# EAGLE design ASM4002 (EAGLE 6.3)
DATABASE: ./../../../../../Components/TinyCircuits_Part_Database.txt
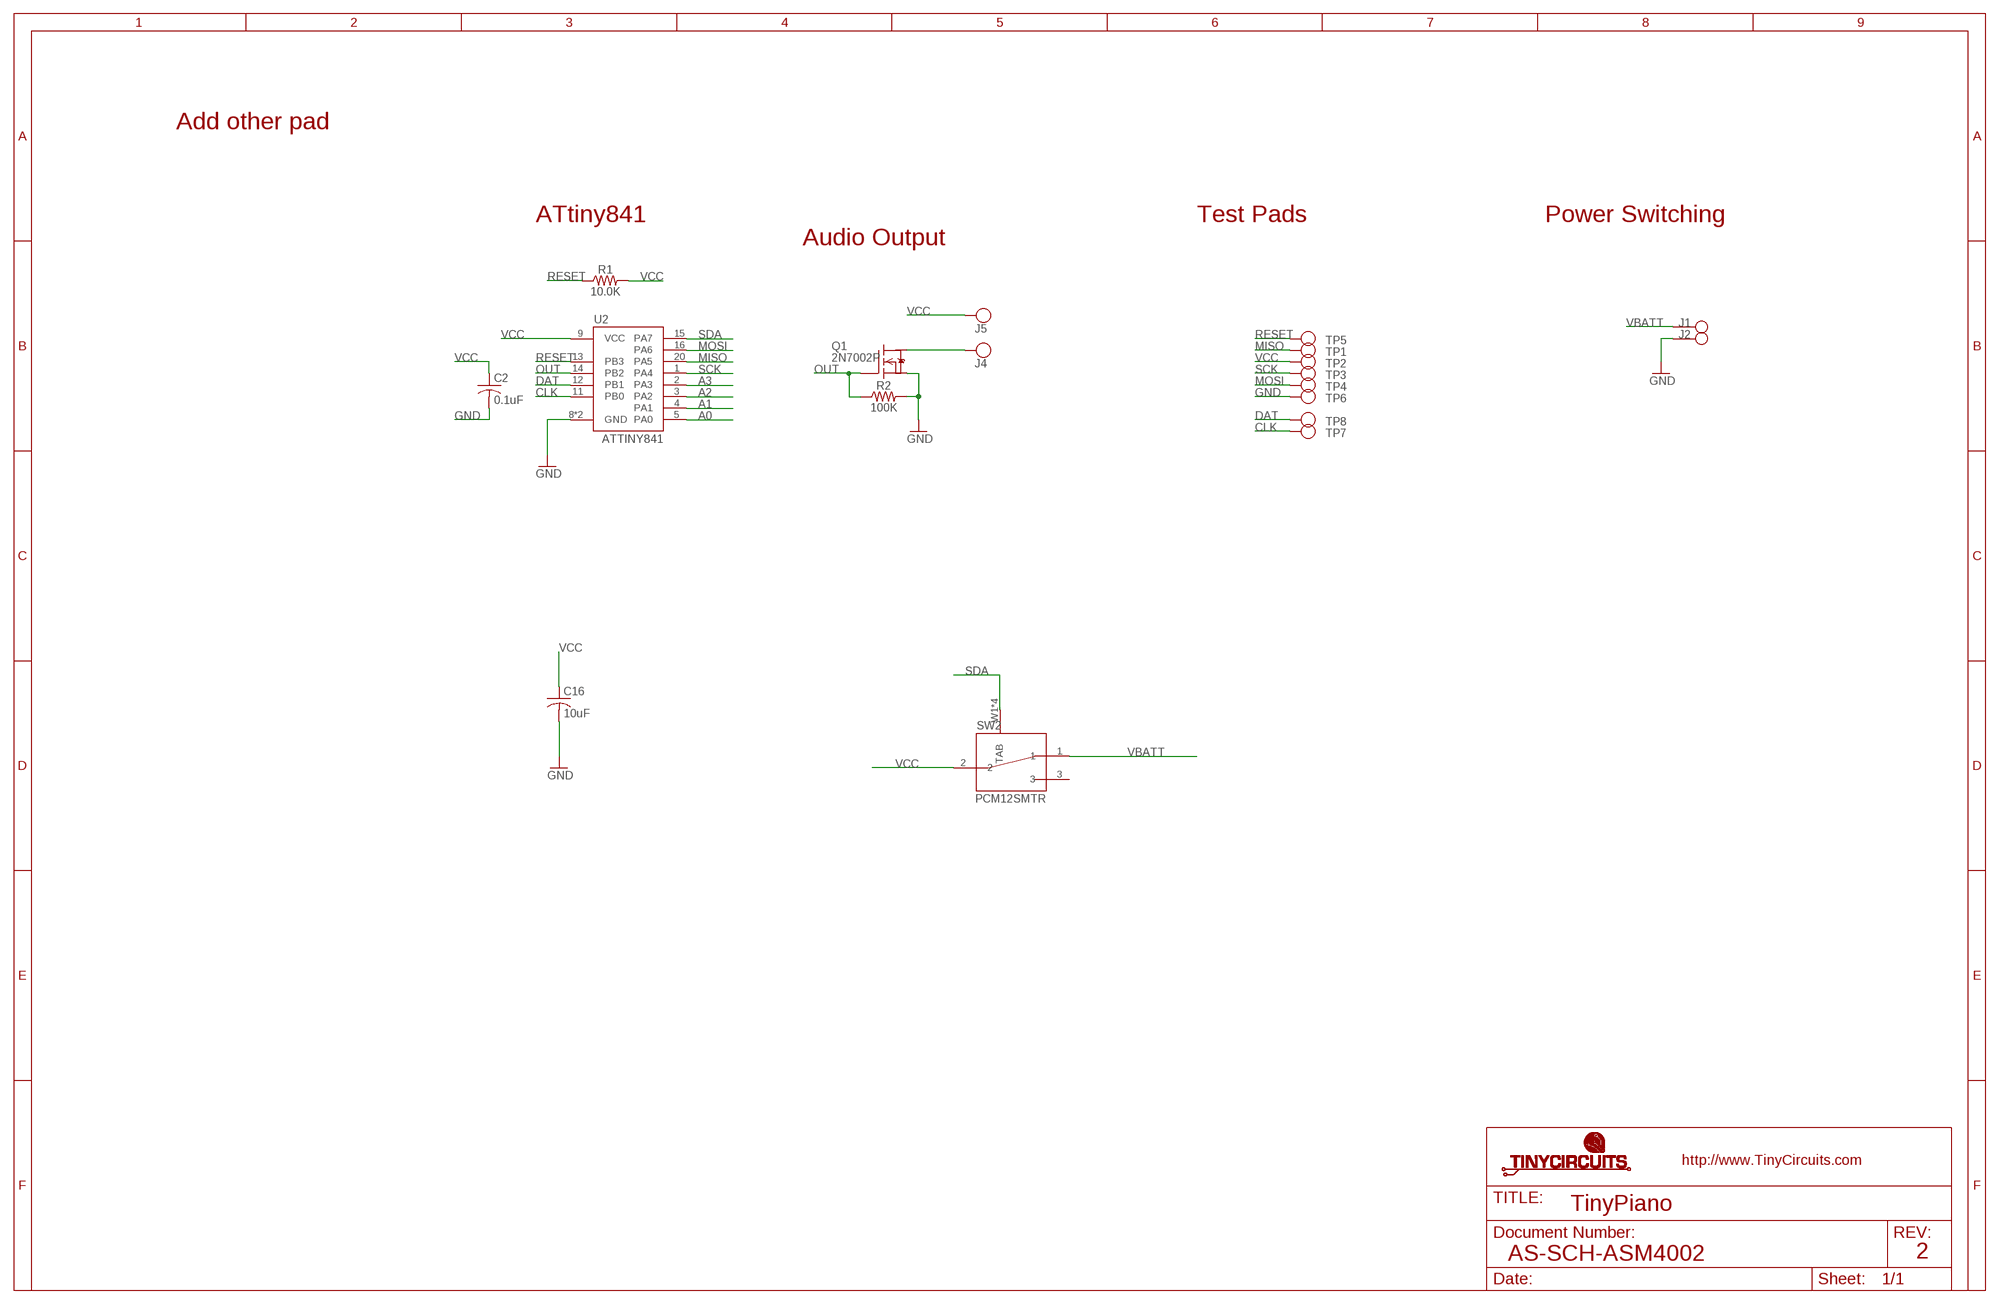
[diagram p0: schematic, sheet 1]

## Parts
C2  0.1uF  AS-ITM-00008  [C0402]
C16  10uF  AS-ITM-00002  [C0603]
J1  PIN_1X.1"  1.4MM_TH  [1.4MM_TH]
J2  1.4MM_TH  [1.4MM_TH]
J4  PIN_1X.1"1  [1X.1"_2]
J5  PIN_1X.1"1  [1X.1"_2]
Q1  2N7002P  AS-ITM-00007C  [SOT23A]
R1  10.0K  AS-ITM-00032  [0402]
R2  100K  AS-ITM-00004  [0402]
SW2  PCM12SMTR  AS-ITM-00220  [PCM12SMTR]
TP1  TEST_POINT  [TEST_POINT_1MM]
TP2  TEST_POINT  [TEST_POINT_1MM]
TP3  TEST_POINT  [TEST_POINT_1MM]
TP4  TEST_POINT  [TEST_POINT_1MM]
TP5  TEST_POINT  [TEST_POINT_1MM]
TP6  TEST_POINT  [TEST_POINT_1MM]
TP7  TEST_POINT  [TEST_POINT_1MM]
TP8  TEST_POINT  [TEST_POINT_1MM]
U2  ATTINY841  AS-ITM-00255  [VQFN-20]

## Nets
A0: U2.5(PA0)
A1: U2.4(PA1)
A2: U2.3(PA2)
A3: U2.2(PA3)
CLK: TP7.P$1 U2.11(PB0)
DAT: TP8.P$1 U2.12(PB1)
GND: C2.2 C16.2 J2.P$1 Q1.E(S) R2.2 TP6.P$1 U2.8(GND) U2.PAD(GND)
MISO: TP1.P$1 U2.20(PA5)
MOSI: TP4.P$1 U2.16(PA6)
N$2: J4.1 Q1.C(D)
OUT: Q1.B(G) R2.1 U2.14(PB2)
RESET: R1.1 TP5.P$1 U2.13(PB3)
SCK: TP3.P$1 U2.1(PA4)
SDA: SW2.W1(TAB) SW2.W2(TAB) SW2.W3(TAB) SW2.W4(TAB) U2.15(PA7)
VBATT: J1.P$1 SW2.1
VCC: C2.1 C16.1 J5.1 R1.2 SW2.2 TP2.P$1 U2.9(VCC)
Unconnected: SW2.3

## Notes on the sheet
- Add other pad
- ATtiny841 | Test Pads | Power Switching
- Audio Output
- TinyPiano
- AS-SCH-ASM4002 | 2

## Library data of the parts
C2 = tinycircuits:AS-ITM-00008: CAP CER 0.1UF 16V 10% X5R 0402; PARTNO: AS-ITM-00008
C16 = tinycircuits:AS-ITM-00002: CAP CER 10UF 10V 20% X5R 0603; PARTNO: AS-ITM-00002
J1 J2 = tinycircuits:1.4MM_TH: 1.4MM Through-Hole Pad for use with pogo pins
J4 J5 = tinycircuits:PIN_1X.1": 1 Pin 0.100" Header
Q1 = tinycircuits:AS-ITM-00007: MOSFET N-CH SGL 60V SOT-23; PARTNO: AS-ITM-00007
R1 = tinycircuits:AS-ITM-00032: RES 10.0K OHM 1/16W 1% 0402 SMD; PARTNO: AS-ITM-00032
R2 = tinycircuits:AS-ITM-00004: RES 100K OHM 1/16W 1% 0402; PARTNO: AS-ITM-00004
SW2 = tinycircuits:AS-ITM-00220: SW SLIDE SP2T 6VDC 0.3A SMT; PARTNO: AS-ITM-00220; PNPROTATION: 0
TP1-TP8 = tinycircuits:TEST_POINT: Test point, no drill
U2 = tinycircuits:AS-ITM-00255: IC MCU 8BIT 8KB FLASH 20VQFN; PARTNO: AS-ITM-00255

## Board
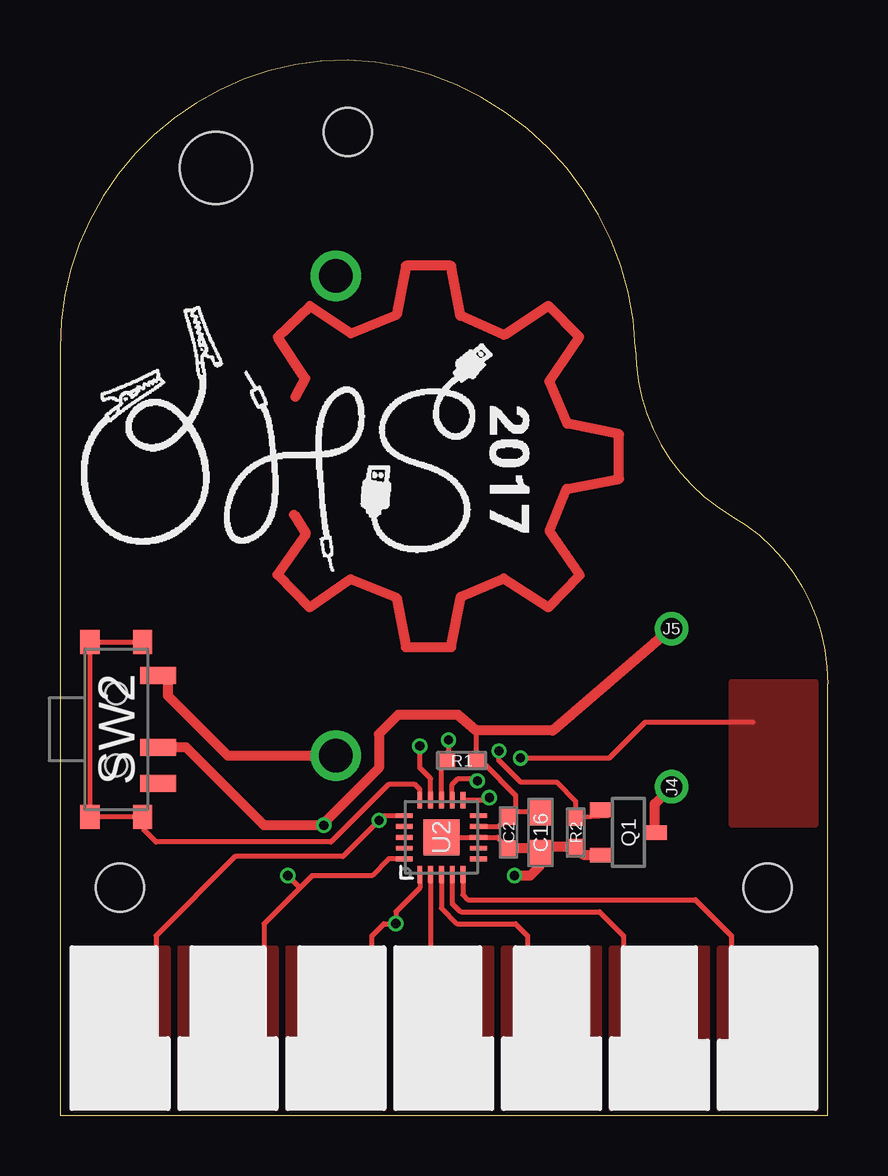
[diagram p1: board, top side]
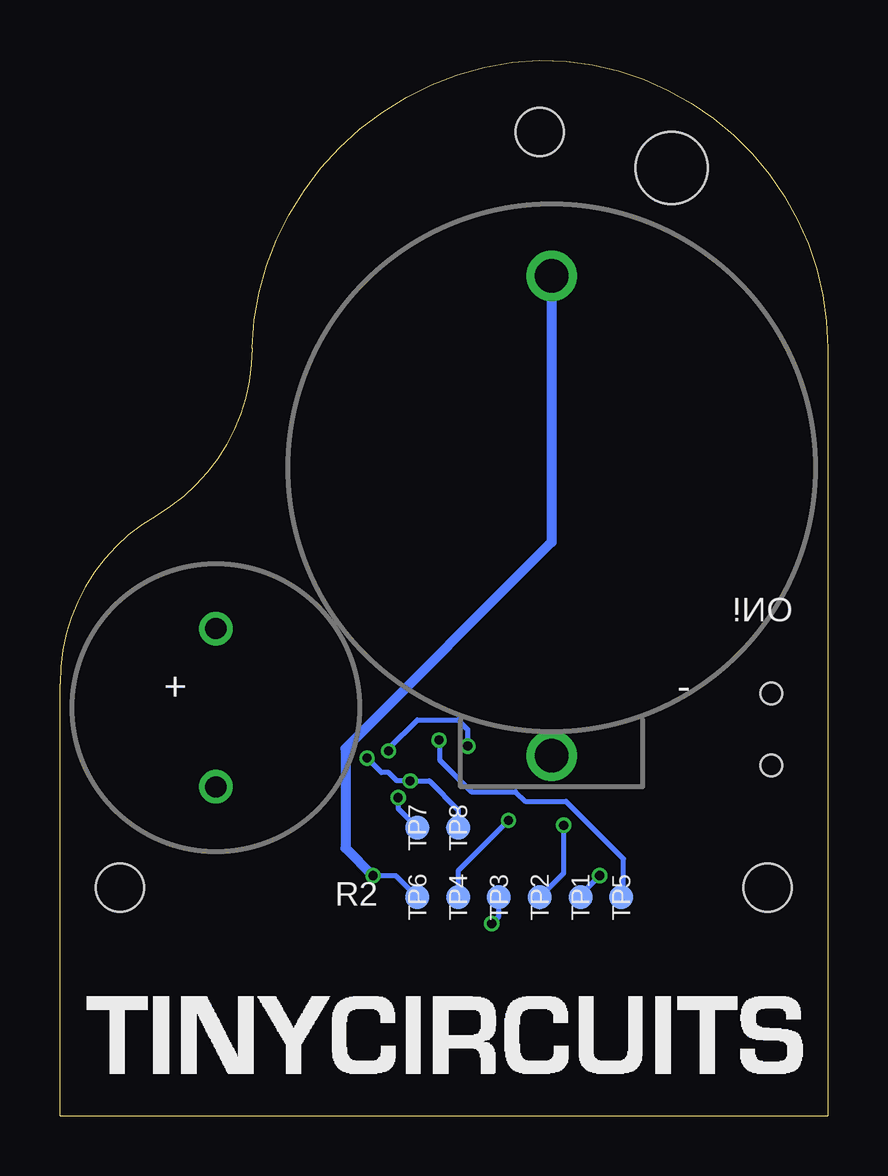
[diagram p2: board, bottom side, seen from below]

Size 32 x 44 mm. Coordinates in mm from the lower left corner, seen from the top.
Outline: 32,0 0,0 0,32 arc-90 12,44 arc-85 24,32 arc60 28,25 arc-60 32,18 32,0
Copper layers (1*16): Top 0.035mm / dielectric 1.5mm / Bottom 0.035mm
Design rules "default *": minimum track width 7mil, minimum drill 15mil, track to track 8mil, track to pad 8mil, pad to pad 8mil, via to via 8mil, smd to smd 8mil, copper to edge 7mil, drill to drill 8mil, minimum pad ring 8mil, minimum via ring 5mil, stop-mask expansion 4mil, vias tented up to drill 25mil, thermal gap 10mil
Holes 2 mm at 29.5,9.5 2.5,9.5 12,41
Holes 3 mm at 6.5,39.5
tRestrict: 4 lines

### Footprints (pad centres in the part's own frame; a part is rotated, then mirrored left to right if it is on the bottom)
C0402 = smd 0.65 x 0.6: 1 -0.65,0; 2 0.65,0
C0603 = smd 1.1 x 1: 1 -0.85,0; 2 0.85,0
1.4MM_TH = drill 1.4: P$1 0,0
1X.1"_2 = drill 0.889 pad 1.397: 1 0,0
SOT23A = smd 0.6 x 1: B -0.95,-1.1; C 0,1.1; E 0.95,-1.1
0402 = smd 0.65 x 0.55: 1 -0.6,0; 2 0.6,0
PCM12SMTR = smd 0.7 x 1.5: 1 -2.25,1.75; 2 0.75,1.75; 3 2.25,1.75 | smd 1 x 0.8: W1 -3.65,1.1; W2 -3.65,-1.1; W3 3.65,-1.1; W4 3.65,1.1 | hole 0.9: 1.5,0; -1.5,0
TEST_POINT_1MM = smd 1 x 1: P$1 0,0
VQFN-20 = smd 0.7 x 0.2: 1 -1.55,0.9; 2 -1.55,0.45; 3 -1.55,0; 4 -1.55,-0.45; 5 -1.55,-0.9; 11 1.55,-0.9; 12 1.55,-0.45; 13 1.55,0; 14 1.55,0.45; 15 1.55,0.9 | smd 0.2 x 0.7: 6 -0.9,-1.55; 7 -0.45,-1.55; 8 0,-1.55; 9 0.45,-1.55; 10 0.9,-1.55; 16 0.9,1.55; 17 0.45,1.55; 18 0,1.55; 19 -0.45,1.55; 20 -0.9,1.55 | smd 1.5 x 1.5: PAD 0,0

### Placement (x,y rotation side)
C2  18.7,11.8 270 top
C16  20.03,11.8 270 top
J1  11.5,15 0 top
J2  11.5,35 0 top
J4  25.5,13.7 90 top
J5  25.5,20.3 0 top
Q1  23.7,11.8 270 top
R1  16.75,14.8 0 top
R2  21.5,11.8 270 top
SW2  2.35,16.1 270 top
TP1  10.3,9.1 270 bottom
TP2  12,9.1 270 bottom
TP3  13.7,9.1 270 bottom
TP4  15.4,9.1 270 bottom
TP5  8.6,9.1 270 bottom
TP6  17.1,9.1 270 bottom
TP7  17.1,12 270 bottom
TP8  15.4,12 270 bottom
U2  15.9,11.6 90 top
U$1  [DOCFIELD-TINYCIRCUITS-PCB]  57.7,-9.2 0 top  (outside the outline)

### Tracks (layer width: path | path; a pad name or v marks a point on that pad's centre or on a via)
A0
  Top 0.203: U2.5 16.8,9.2 17,9 26.5,9 28,7.5 28,6
  pour Top: 27.5,0 27.5,7 31.5,7 31.5,0
A1
  Top 0.203: U2.4 16.35,8.85 16.7,8.5 22.5,8.5 23.5,7.5 23.5,6.3 23.7,6.1
  pour Top: 23,0 23,7 27,7 27,0
A2
  Top 0.203: U2.3 15.9,8.65 16.55,8 19,8 19.5,7.5 19.5,6.5
  pour Top: 18.5,0 18.5,7 22.5,7 22.5,0
A3
  Top 0.203: U2.2 15.45,6.95 15.5,6.5
  pour Top: 14,0 14,7 18,7 18,0
CLK  (via drill 0.38)
  Top 0.203: U2.11 17.8,13.15 v17.9,13.25
  Bottom 0.203: v17.9,13.25 17.9,12.8 TP7.P$1
DAT  (via drill 0.38)
  Top 0.203: U2.12 16.35,13.8 16.6,14.05 17.3,14.05 v17.4,13.95 | v19.2,14.9 22.9,14.9 24.4,16.4 28.9,16.4
  Bottom 0.203: TP8.P$1 15.4,12.75 16.6,13.95 v17.4,13.95 17.95,13.95 18.3,14.3 18.6,14.3 v19.2,14.9
  pour Top: 28,12.1 28,18.1 31.5,18.1 31.5,12.1
GND  (via drill 0.38)
  Top 0.203: U2.PAD U2.8 18.25,11.6 C2.2
  Top 0.406: C2.2 19.83,11.15 C16.2 | Q1.E 21.85,10.85 R2.2 20.28,11.2 C16.2 | C16.2 20.03,10.43 19.6,10 v18.95,10
  Bottom 0.203: TP6.P$1 18,10 v18.95,10
  Bottom 0.406: J2.P$1 11.5,23.9 20.1,15.3 20.1,11.15 v18.95,10
MISO  (via drill 0.38)
  Top 0.203: U2.20 13.7,10.7 13,10 10.5,10 10,9.5 | 10,9.5 8.5,8 8.5,6.5 8,6 | v9.5,10 10,9.5
  Bottom 0.203: TP1.P$1 10.3,9.2 v9.5,10
  pour Top: 5,0 5,7 9,7 9,0
MOSI  (via drill 0.38)
  Top 0.203: 4,6.5 4,7.5 7.3,10.8 11.8,10.8 v13.3,12.3 13.5,12.5 U2.16
  Bottom 0.203: v13.3,12.3 15.4,10.2 TP4.P$1
  pour Top: 0.5,0 0.5,7 4.5,7 4.5,0
N$2
  Top 0.406: Q1.C 24.8,13 J4.1
N$3
  Top 0.406: 9.76,25.05 10.25,24.24 9.07,22.55 10.4,21.18 12.12,22.36 14.03,21.59 14.42,19.53 16.31,19.53 16.71,21.63 18.49,22.39 20.36,21.18 21.67,22.53 20.41,24.36 21.12,26.12 23.31,26.54 23.31,28.4 21.15,28.84 20.4,30.61 21.65,32.45 20.36,33.76 18.51,32.54 16.69,33.34 16.31,35.42 14.42,35.42 14.03,33.37 12.13,32.6 10.42,33.75 9.08,32.45 10.22,30.72 9.81,29.95
OUT  (via drill 0.38)
  Top 0.203: U2.14 15.45,14.05 15,14.5 v15,15.4 | Q1.B 22.85,12.5 R2.1 21.5,13.1 20.7,13.9 19.2,13.9 18.3,14.8 v18.3,15.2
  Bottom 0.203: v18.3,15.2 18.3,15.3 17.1,16.5 15.4,16.5 15,16.1 v15,15.4
RESET  (via drill 0.38)
  Top 0.203: v16.2,15.65 16.2,14.7 R1.1 15.9,14.45 U2.13
  Bottom 0.203: TP5.P$1 8.5,9.2 8.5,10.7 10.9,13.1 12.6,13.1 13,13.5 14.85,13.5 R1.1 16.15,15.6 v16.2,15.65
SCK  (via drill 0.38)
  Top 0.203: U2.1 15,9.5 14,8.5 v14,8 13.5,8 13,7.5 13,7 12.5,6.5
  Bottom 0.203: v14,8 13.7,8.3 TP3.P$1
  pour Top: 9.5,0 9.5,7 13.5,7 13.5,0
SDA
  Top 0.203: U2.15 15,13.6 14.8,13.8 13.7,13.8 11.3,11.4 4,11.4 3.5,11.9 3.5,12.4 SW2.W4 SW2.W3 SW2.W2 SW2.W1
VBATT
  Top 0.406: J1.P$1 7,15 4.5,17.5 4.5,18.35 SW2.1
VCC  (via drill 0.38)
  Top 0.203: U2.9 18.3,12.05 C2.1 | C2.1 19,12.55 19,13.35 17.7,14.65 17.35,14.65 R1.2 17.35,16.05 | 10.9,12.1 10.9,12 v11,12.1 | C16.1 18.9,12.65 C2.1
  Top 0.406: J5.1 20.55,16.05 17.35,16.05 16.6,16.7 14.1,16.7 13.3,15.9 13.3,14.5 10.9,12.1 8.5,12.1 5.25,15.35 SW2.2
  Bottom 0.203: v11,12.1 11,10.1 TP2.P$1

### Text on the board
bPlace: ON! | - | + | R2
Document: FABRICATION DRAWING | NOTES: | 1. PRINTED CIRCUIT BOARD MADE FROM NEMA GRADE FR-4 EPOXY LAMINATE | WITH 1 OUNCE COPPER PLATING AND .024 THICKNESS. | 2. ALL DIMENSIONS ARE GIVEN IN INCHES. | 3. CIRCUIT PATHS ARE FOR REFERENCE ONLY. | 4. HOLE SIZES SHOWN ARE FINISHED DIAMETERS AFTER PLATING. | 5. BOARD PLATED USING REFLOW OR SIMILAR METHOD. | 6. BOARD TO HAVE BLUE SOLDER MASK ON PLATED SURFACES USING WET FILM | 7. SILKSCREEN BOARD USING WHITE INK. | SR100 OR SR1010 EPOXY. EQUIVALENT WET OR DRY FILM MAY BE USED. | 8. THE FOLLOWING INFORMATION APPLIES TO THIS BOARD: | * 2 COPPER LAYERS | * .024 BOARD THICKNESS | * REQUIRES TOP SIDE SILKSCREEN | TinyPiano | AS-PCB-ASM4002 | 2